# EAGLE schematic teemsyUp (EAGLE 9.1.3)
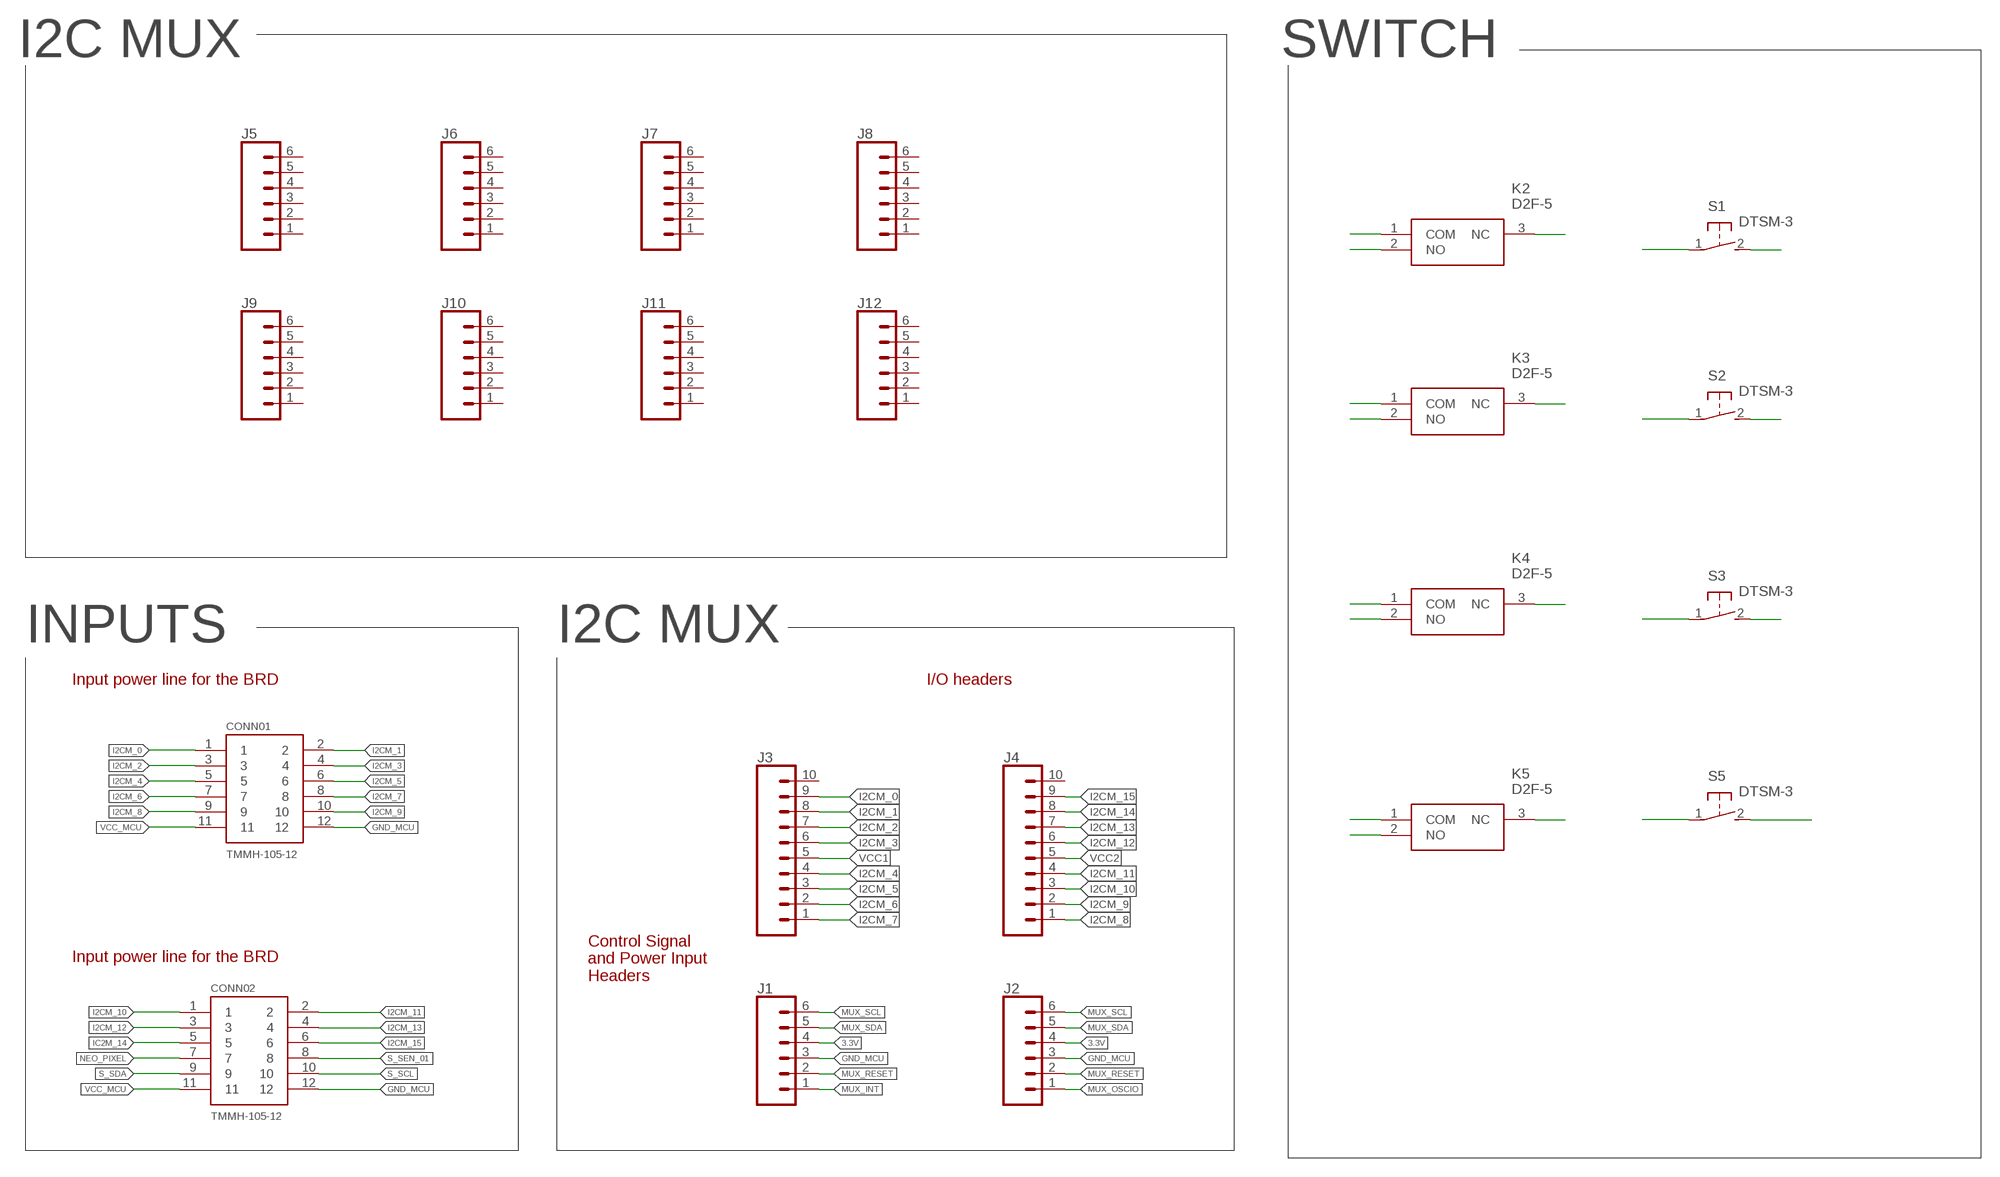
[diagram p0: schematic, sheet 1]

## Parts
CONN01  TMMH-105-12  [TMMH-105-12]
CONN02  TMMH-105-12  [TMMH-105-12]
J1  CONN_06SMD_MALE  [1X06_SMD_MALE]
J2  CONN_06SMD_MALE  [1X06_SMD_MALE]
J3  CONN_10SMD_MALE  [1X10_SMD_MALE]
J4  CONN_10SMD_MALE  [1X10_SMD_MALE]
J5  CONN_06SMD-1MM  [1X06-1MM]
J6  CONN_06SMD-1MM  [1X06-1MM]
J7  CONN_06SMD-1MM  [1X06-1MM]
J8  CONN_06SMD-1MM  [1X06-1MM]
J9  CONN_06SMD-1MM  [1X06-1MM]
J10  CONN_06SMD-1MM  [1X06-1MM]
J11  CONN_06SMD-1MM  [1X06-1MM]
J12  CONN_06SMD-1MM  [1X06-1MM]
K2  D2F-5  [SHDR3W100P0X508_1X3_1280X580X5]
K3  D2F-5  [SHDR3W100P0X508_1X3_1280X580X5]
K4  D2F-5  [SHDR3W100P0X508_1X3_1280X580X5]
K5  D2F-5  [SHDR3W100P0X508_1X3_1280X580X5]
S1  DTSM-3  [DTSM-3]
S2  DTSM-3  [DTSM-3]
S3  DTSM-3  [DTSM-3]
S5  DTSM-3  [DTSM-3]

## Nets
3.3V: J1.4 J2.4
GND_MCU: CONN01.12 CONN02.12 J1.3 J2.3
I2CM_0: CONN01.1 J3.9
I2CM_1: CONN01.2 J3.8
I2CM_2: CONN01.3 J3.7
I2CM_3: CONN01.4 J3.6
I2CM_4: CONN01.5 J3.4
I2CM_5: CONN01.6 J3.3
I2CM_6: CONN01.7 J3.2
I2CM_7: CONN01.8 J3.1
I2CM_8: CONN01.9 J4.1
I2CM_9: CONN01.10 J4.2
I2CM_10: CONN02.1 J4.3
I2CM_11: CONN02.2 J4.4
I2CM_12: CONN02.3 J4.6
I2CM_13: CONN02.4 J4.7
I2CM_14: J4.8
I2CM_15: CONN02.6 J4.9
IC2M_14: CONN02.5
MUX_INT: J1.1
MUX_OSCIO: J2.1
MUX_RESET: J1.2 J2.2
MUX_SCL: J1.6 J2.6
MUX_SDA: J1.5 J2.5
N$1: S1.1
N$7: S1.2
N$10: S2.1
N$11: S2.2
N$12: S3.2
N$13: S3.1
N$14: S5.1
N$15: S5.2
N$16: K5.3(NC)
N$17: K4.3(NC)
N$18: K3.3(NC)
N$19: K2.3(NC)
N$20: K2.1(COM)
N$21: K2.2(NO)
N$22: K3.1(COM)
N$23: K3.2(NO)
N$24: K4.1(COM)
N$25: K4.2(NO)
N$26: K5.1(COM)
N$27: K5.2(NO)
NEO_PIXEL: CONN02.7
S_SCL: CONN02.10
S_SDA: CONN02.9
S_SEN_01: CONN02.8
VCC1: J3.5
VCC2: J4.5
VCC_MCU: CONN01.11 CONN02.11
Unconnected: J3.10 J4.10 J5.1 J5.2 J5.3 J5.4 J5.5 J5.6 J6.1 J6.2 J6.3 J6.4 J6.5 J6.6 J7.1 J7.2 J7.3 J7.4 J7.5 J7.6 J8.1 J8.2 J8.3 J8.4 J8.5 J8.6 J9.1 J9.2 J9.3 J9.4 J9.5 J9.6 J10.1 J10.2 J10.3 J10.4 J10.5 J10.6 J11.1 J11.2 J11.3 J11.4 J11.5 J11.6 J12.1 J12.2 J12.3 J12.4 J12.5 J12.6

## Notes on the sheet
- I2C MUX | SWITCH
- INPUTS | I2C MUX
- Input power line for the BRD | I/O headers
- Control Signal
  and Power Input
  Headers
- Input power line for the BRD

## Library data of the parts
CONN01 CONN02 = TMMH-105-XX-XX-DV:TMMH-105-12: 2mm (.0787") Flex Shroud, .020" (.51mm) Square Post Terminal Strip, Surface Mount,10 Pins.
J1 J2 = SparkFun-Connectors:CONN_06: Multi connection point. Often used as Generic Header-pin footprint for 0.1 inch spaced/style header connections On any of the 0.1 inch spaced packages, you can populate with these: Break Away Headers - Straight <https://www.sparkfun.com/products/116> (PRT-00116) Break Away Male Headers - Right Angle <https://www.sparkfun.com/products/553> (PRT-00553) Female Headers <https://www.sparkfun.com/products/115> (PRT-00115) Break Away Headers - Machine Pin <https://www.sparkfun.com/products/117> (PRT-00117) Break Away Female Headers - Swiss Machine Pin <https://www.sparkfun.com/products/743> (PRT-00743) Arduino Stackable Header - 6 Pin <https://www.sparkfun.com/products/9280> (PRT-09280) For SCREWTERMINALS and SPRING TERMINALS visit here: Screw Terimnals on SparkFun.com <https://www.sparkfun.com/search/results?term=Screw+Terminals> (5mm/3.5mm/2.54mm spacing) This device is also useful as a general connection point to wire up your design to another part of your project. Our various solder wires solder well into these plated through hole pads. Hook-Up Wire - Assortment (Stranded, 22 AWG) <https://www.sparkfun.com/products/11375> (PRT-11375) Hook-Up Wire - Assortment (Solid Core, 22 AWG) <https://www.sparkfun.com/products/11367> (PRT-11367) View the entire wire category on our website here <https://www.sparkfun.com/categories/141>; PROD_ID: CONN-11293
J3 J4 = SparkFun-Connectors:CONN_10: Multi connection point. Often used as Generic Header-pin footprint for 0.1 inch spaced/style header connections On any of the 0.1 inch spaced packages, you can populate with these: Break Away Headers - Straight <https://www.sparkfun.com/products/116> (PRT-00116) Break Away Male Headers - Right Angle <https://www.sparkfun.com/products/553> (PRT-00553) Female Headers <https://www.sparkfun.com/products/115> (PRT-00115) Break Away Headers - Machine Pin <https://www.sparkfun.com/products/117> (PRT-00117) Break Away Female Headers - Swiss Machine Pin <https://www.sparkfun.com/products/743> (PRT-00743) Arduino Stackable Header - 10 Pin <https://www.sparkfun.com/products/11376> (PRT-11376) For SCREWTERMINALS and SPRING TERMINALS visit here: Screw Terimnals on SparkFun.com <https://www.sparkfun.com/search/results?term=Screw+Terminals> (5mm/3.5mm/2.54mm spacing) This device is also useful as a general connection point to wire up your design to another part of your project. Our various solder wires solder well into these plated through hole pads. Hook-Up Wire - Assortment (Stranded, 22 AWG) <https://www.sparkfun.com/products/11375> (PRT-11375) Hook-Up Wire - Assortment (Solid Core, 22 AWG) <https://www.sparkfun.com/products/11367> (PRT-11367) View the entire wire category on our website here <https://www.sparkfun.com/categories/141> Special notes: Molex polarized connector foot print use with SKU : PRT-08231 with associated crimp pins and housings. 1MM SMD Version SKU: PRT-10208 NOTES ON THE VARIANTS LOCK and LOCK_LONGPADS... This footprint was designed to help hold the alignment of a through-hole component (i.e. 6-pin header) while soldering it into place. You may notice that each hole has been shifted either up or down by 0.005 of an inch from it's more standard position (which is a perfectly straight line). This slight alteration caused the pins (the squares in the middle) to touch the edges of the holes. Because they are alternating, it causes a "brace" to hold the component in place. 0.005 has proven to be the perfect amount of "off-center" position when using our standard breakaway headers. Although looks a little odd when you look at the bare footprint, once you have a header in there, the alteration is very hard to notice. Also,if you push a header all the way into place, it is covered up entirely on the bottom side.; PROD_ID: CONN-11291
J5-J12 = SparkFun-Connectors:CONN_06: Multi connection point. Often used as Generic Header-pin footprint for 0.1 inch spaced/style header connections On any of the 0.1 inch spaced packages, you can populate with these: Break Away Headers - Straight <https://www.sparkfun.com/products/116> (PRT-00116) Break Away Male Headers - Right Angle <https://www.sparkfun.com/products/553> (PRT-00553) Female Headers <https://www.sparkfun.com/products/115> (PRT-00115) Break Away Headers - Machine Pin <https://www.sparkfun.com/products/117> (PRT-00117) Break Away Female Headers - Swiss Machine Pin <https://www.sparkfun.com/products/743> (PRT-00743) Arduino Stackable Header - 6 Pin <https://www.sparkfun.com/products/9280> (PRT-09280) For SCREWTERMINALS and SPRING TERMINALS visit here: Screw Terimnals on SparkFun.com <https://www.sparkfun.com/search/results?term=Screw+Terminals> (5mm/3.5mm/2.54mm spacing) This device is also useful as a general connection point to wire up your design to another part of your project. Our various solder wires solder well into these plated through hole pads. Hook-Up Wire - Assortment (Stranded, 22 AWG) <https://www.sparkfun.com/products/11375> (PRT-11375) Hook-Up Wire - Assortment (Solid Core, 22 AWG) <https://www.sparkfun.com/products/11367> (PRT-11367) View the entire wire category on our website here <https://www.sparkfun.com/categories/141>; PROD_ID: CONN-08249; SF_ID: GPS-00579
K2-K5 = D2F-5:D2F-5: OMRON ELECTRONIC COMPONENTS - D2F-5 - MICROSWITCH, PLUNGER, SPDT, 5A, 250V, TH Source: Datasheet <http://omronfs.omron.com/en_US/ecb/products/pdf/en-d2f.pdf>; ALLIED_NUMBER: 71203873; ALLIED_PRICE-STOCK: https://www.alliedelec.com/omron-electronic-components-d2f-5/71203873/; DESCRIPTION: OMRON ELECTRONIC COMPONENTS - D2F-5 - MICROSWITCH, PLUNGER, SPDT, 5A, 250V, TH; HEIGHT: 5.8mm; MANUFACTURER_NAME: Omron Electronics; MANUFACTURER_PART_NUMBER: D2F-5; MOUSER_PART_NUMBER: 653-D2F-5; MOUSER_PRICE-STOCK: https://www.mouser.com/Search/Refine.aspx?Keyword=653-D2F-5
S1-S3 S5 = switch-tact:DTSM-3